# EasyEDA Pro project pcb.epro

# Board PCB_PCB_Occula-Zero-Control-Board-Teensy-Rev-2_2025_1_10
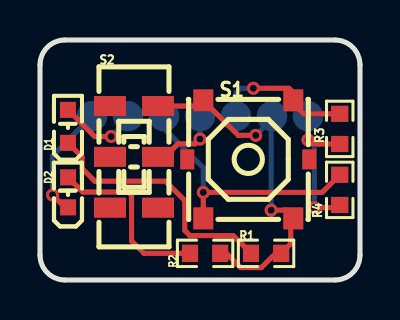
[diagram p0: board, top side]
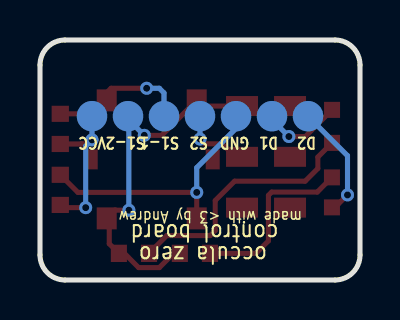
[diagram p1: board, bottom side, seen from below]

Outline 16 x 12 mm; copper layers: Top Layer, Bottom Layer. Coordinates in mm from the lower left corner of the outline.
Outline path: 0,10.75 0,1.25 arc(0.37,0.37) 1.25,0 14.75,0 arc(15.63,0.37) 16,1.25 16,10.75 arc(15.63,11.63) 14.75,12 1.25,12 arc(0.37,11.63) 0,10.75
Stack: Top Layer 0.035mm / Dielectric1 1.51mm FR4 er 4.5 / Bottom Layer 0.035mm

## Design rules (mm)
template: JLCPCB Capability(Two Layers Board)
spacing copperThickness1oz (default): track to track 0.102, other pairs 0.152 to 0.3
spacing copperThickness2oz: track to track 0.203, other pairs 0.152 to 0.3
track width copperThickness1oz (default): min 0.127, default 0.254, max 2.54
track width copperThickness2oz: min 0.203, default 0.254, max 2.54
differential pair differentialPair (default): width min 0.127, default 0.254, max 2.54; gap min 0.152, default 0.152
via viaSize (default): diameter min 0.5, default 0.61, max 10; hole min 0.3, default 0.305, max 6.3

## Placement (name value [footprint] x y rotation side)
D1  APT1608LZGCK  [LED_APT1608LZGCK]  1.4 7.68 90 top
D2  APTD1608LSECK/J3-PF  [LED-SMD_L1.6-W0.8-RD]  1.4 4.38 90 top
NOREF  -  [Pad_e16]  13.4 8.19 0 top
NOREF#2  -  [Pad_e13]  8 8.19 0 top
NOREF#3  -  [Pad_e14]  9.8 8.19 0 top
NOREF#4  -  [Pad_e7]  2.6 8.19 0 top
NOREF#5  -  [Pad_e15]  11.6 8.19 0 top
NOREF#6  -  [Pad_e12]  6.2 8.19 0 top
NOREF#7  -  [Pad_e10]  4.4 8.19 0 top
R1  330Ω  [R0603]  11.3 1.33 0 top
R2  750Ω  [R0603]  8.26 1.33 0 top
R3  10kΩ  [R0603]  14.99 7.56 90 top
R4  10kΩ  [R0603]  14.99 4.51 90 top
S1  SKRNPAE010  [SW-SMD_6P-L6.0-W6.0-P4.50-LS6.4]  10.41 6.03 270 top
S2  JS202011JCQN  [SW-SMD_JS202011JCQN]  4.7 6.16 90 top

## Footprints (pads in the part's own frame, mm; a bottom-side part is the same pattern mirrored in y, then rotated)
LED-SMD_L1.6-W0.8-RD
  rect 0.8x0.8 smd: 1(-0.75,0) 2(0.75,0)
LED_APT1608LZGCK
  rect 0.8x0.8 smd: 1(-0.825,0) 2(0.825,0)
Pad_e7
  round 1.524 smd far side: 1(0,0)
Pad_e10
  round 1.524 smd far side: 1(0,0)
Pad_e12
  round 1.524 smd far side: 1(0,0)
Pad_e13
  round 1.524 smd far side: 1(0,0)
Pad_e14
  round 1.524 smd far side: 1(0,0)
Pad_e15
  round 1.524 smd far side: 1(0,0)
Pad_e16
  round 1.524 smd far side: 1(0,0)
R0603
  rect 0.806x0.864 smd: 1(-0.753,0) 2(0.753,0)
SW-SMD_6P-L6.0-W6.0-P4.50-LS6.4
  rect 1.1x1 smd: 1(-2.95,2.25) 2(2.95,2.25) 3(-2.95,-2.25) 4(2.95,-2.25)
  rect 1x0.7 smd: 5(0,3.05) 6(0,-3.05)
SW-SMD_JS202011JCQN
  rect 1x1.6 smd: 1(-2.54,1.2) 2(0,1.2) 3(2.54,1.2) 5(-2.54,-1.2) 6(0,-1.2) 7(2.54,-1.2)

## Nets
GND: NOREF#5.1 R1.2 R2.2 S1.2 S1.3 S2.7
VCC: NOREF.1 R3.1 R4.1
D1: D1.2 NOREF#7.1
D2: D2.1 NOREF#4.1
S1-1: NOREF#3.1 R3.2 S1.1
S1-2: NOREF#6.1 R4.2 S1.4
S2: NOREF#2.1 S2.6
$1N368: D2.2 R2.1
$1N370: D1.1 R1.1

Pads without a net: S1 5 6; S2 1 2 3 5

## Via types
v1: diameter 0.65, hole 0.354, Top Layer to Bottom Layer, 9 vias

## Routing (per net, layer and track width the routed paths; a pad name or vN(x,y) marks a point on that pad's centre or on a via; arc(x,y) is an arc through that point)
GND: length 18.4
  Top Layer w0.254: v1(10.79,7.23) 9.91,7.23 S1.3 7.88,8.7 S2.7 ; v1(11.56,3.49) 12.25,3.49 S1.2 ; R2.2 9.32,1.33 10.03,0.62 11.07,0.62 11.78,1.33 R1.2 12.54,1.81 12.54,3.05
  Bottom Layer w0.254: 11.56,8 11.6,8.05 NOREF#5.1 ; 11.56,8 v1(11.56,3.49) ; 11.56,8 v1(10.79,7.23)
VCC: length 7.7
  Top Layer w0.254: v1(13.4,7.01) 13.6,6.81 13.93,6.81 13.94,6.8 R3.1 ; v1(13.72,3.62) 14.85,3.62 R4.1
  Bottom Layer w0.254: v1(13.72,3.62) 13.72,6.69 v1(13.4,7.01) NOREF.1
D1: length 4.1
  Top Layer w0.254: D1.2 2.73,7.17 v1(3.56,7.17)
  Bottom Layer w0.254: v1(3.56,7.17) 4.4,8.02 NOREF#7.1
D2: length 5.8
  Top Layer w0.254: D2.1 1.25,3.63 v1(0.62,4.25)
  Bottom Layer w0.254: v1(0.62,4.25) 0.62,6.22 NOREF#4.1
S1-1: length 7.2
  Top Layer w0.254: 12.67,8.82 13.18,8.31 R3.2 ; v1(10.67,9.59) 12.45,9.59 12.66,9.37 S1.1 ; 12.54,8.95 12.59,8.9
  Bottom Layer w0.254: NOREF#3.1 9.8,9.35 10.03,9.59 v1(10.67,9.59)
S1-2: length 13.1
  Top Layer w0.254: S1.4 v1(8.16,4.38) 14.11,4.38 R4.2
  Bottom Layer w0.254: v1(8.16,4.38) 8.16,5.61 6.2,7.58 NOREF#6.1
S2: length 3.6
  Top Layer w0.254: v1(8,7.05) 7.76,6.81 6.9,6.81 6.25,6.16 S2.6
  Bottom Layer w0.254: v1(8,7.05) 8,8.19
$1N368: length 9
  Top Layer w0.254: D2.2 2.14,4.4 4.41,4.4 4.58,4.23 4.58,1.95 5.2,1.33 R2.1
$1N370: length 12.7
  Top Layer w0.254: R1.1 9.66,2.22 7.49,2.22 7.24,2.48 7.24,3.97 6.27,4.94 2.74,4.94 2.11,5.58 2.11,6.15 D1.1

## Text on the board
Bottom Silkscreen Layer: made with <3 by Andrew | D2 | D1 | GND | S2 | S1-1 | S1-2 | VCC | control board | occula zero
